# EAGLE schematic Power Board rev3 (EAGLE 8.2.1)
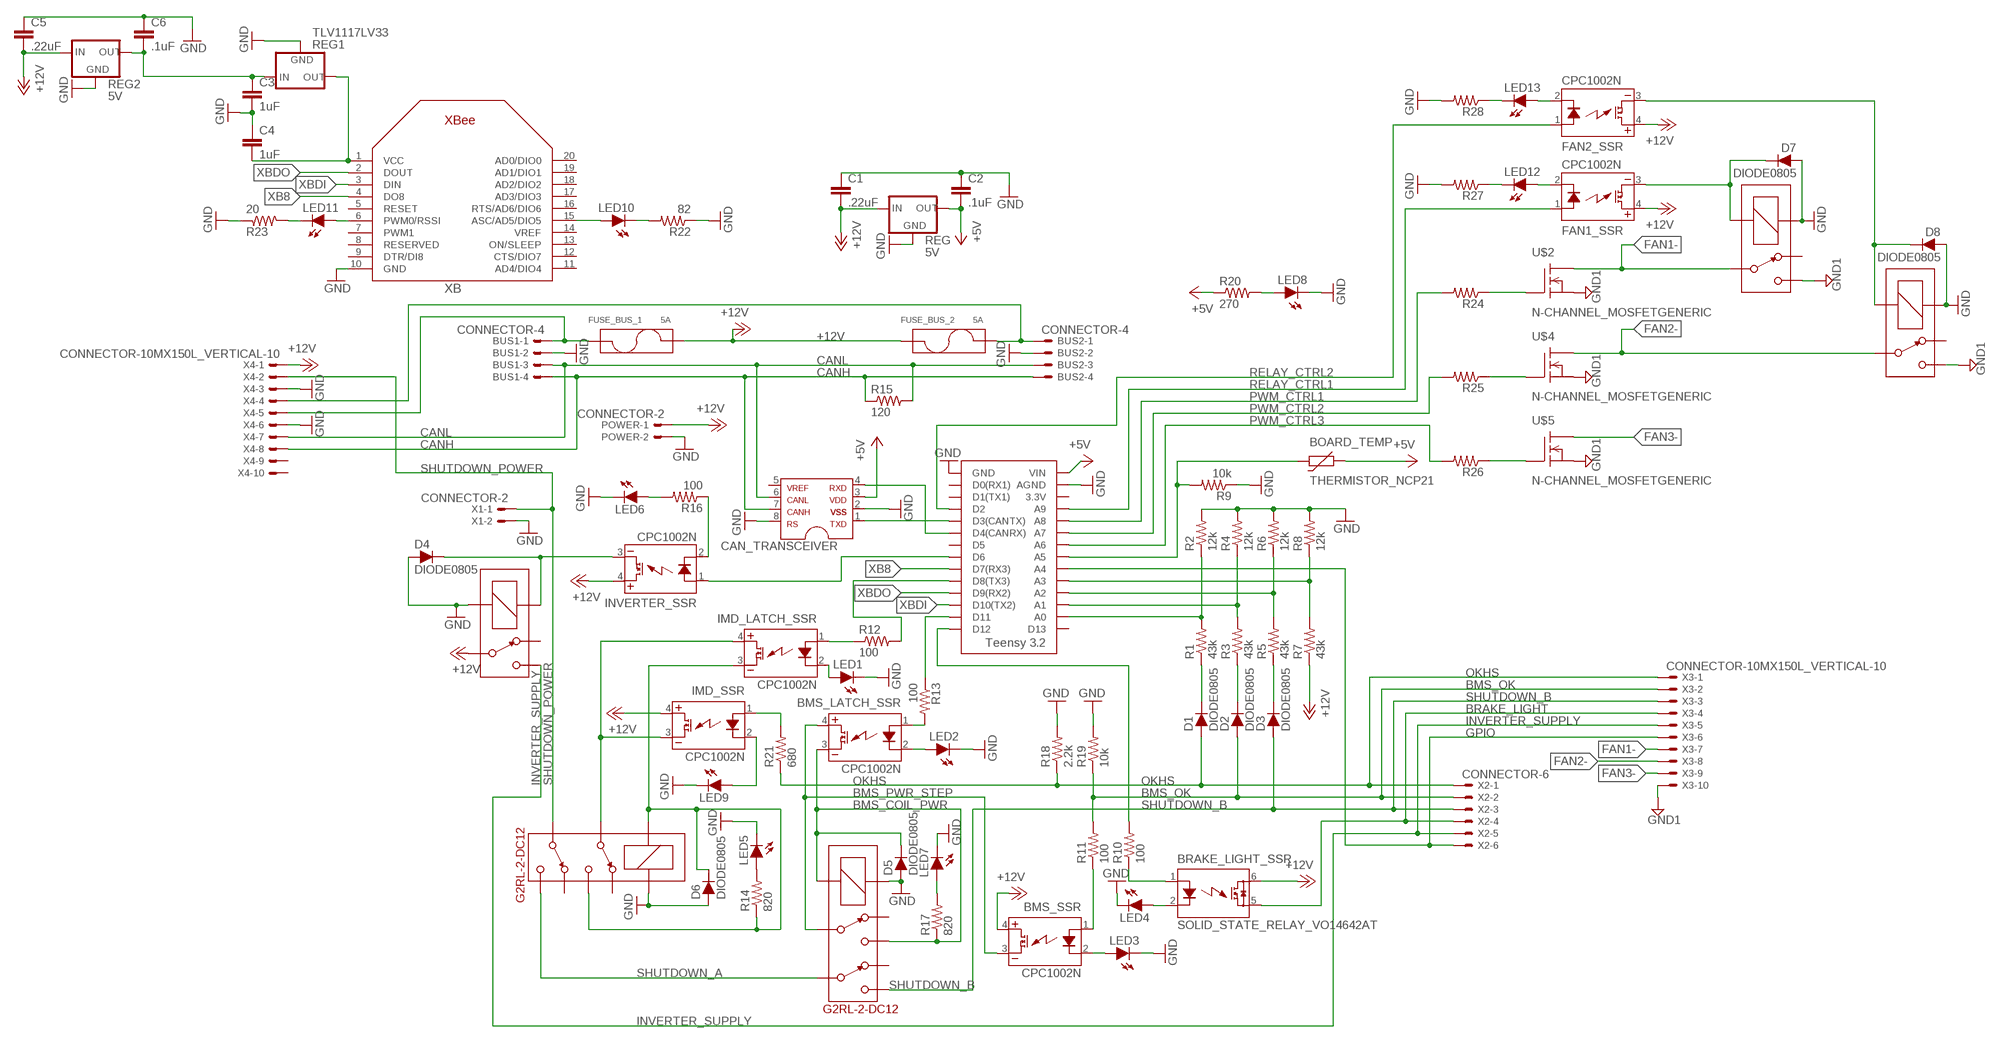
[diagram p0: schematic, sheet 1]

## Parts
BMS_LATCH_SSR  CPC1002N  [SOP04]
BMS_SSR  CPC1002N  [SOP04]
BOARD_TEMP  THERMISTOR_NCP21  [0805]
BRAKE_LIGHT_SSR  SOLID_STATE_RELAY_VO14642AT  [DIL06]
BUS1  CONNECTOR-4  [MINIFIT_5566-4]
BUS2  CONNECTOR-4  [MINIFIT_5566-4]
C1  .22uF  CAP0805  [0805]
C2  .1uF  CAP0805  [0805]
C3  1uF  CAP0805  [0805]
C4  1uF  CAP0805  [0805]
C5  .22uF  CAP0805  [0805]
C6  .1uF  CAP0805  [0805]
CAN_TRANSCEIVER  MCP2551  [SOIC-08]
D1  DIODE0805  [0805_D]
D2  DIODE0805  [0805_D]
D3  DIODE0805  [0805_D]
D4  DIODE0805  [0805_D]
D5  DIODE0805  [0805_D]
D6  DIODE0805  [0805_D]
D7  DIODE0805  [0805_D]
D8  DIODE0805  [0805_D]
FAN1_SSR  CPC1002N  [SOP04]
FAN2_SSR  CPC1002N  [SOP04]
FUSE_BUS_1  5A  FUSE_MINIBLADE  [MINI-BLADE_FUSE_HOLDER]
FUSE_BUS_2  5A  FUSE_MINIBLADE  [MINI-BLADE_FUSE_HOLDER]
IMD_LATCH_SSR  CPC1002N  [SOP04]
IMD_SHUTDOWN  G2RL-2-DC12  [G2RL-2]
IMD_SHUTDOWN1  G2RL-2-DC12  [G2RL-2]
IMD_SSR  CPC1002N  [SOP04]
INVERTER_SSR  CPC1002N  [SOP04]
LED1  LED-0805  [LED-805]
LED2  LED-0805  [LED-805]
LED3  LED-0805  [LED-805]
LED4  LED-0805  [LED-805]
LED5  LED-0805  [LED-805]
LED6  LED-0805  [LED-805]
LED7  LED-0805  [LED-805]
LED8  LED-0805  [LED-805]
LED9  LED-0805  [LED-805]
LED10  LED-0805  [LED-805]
LED11  LED-0805  [LED-805]
LED12  LED-0805  [LED-805]
LED13  LED-0805  [LED-805]
POWER  CONNECTOR-2  [MINIFIT_5566-2]
R1  43k  RESISTOR0805-RES  [0805]
R2  12k  RESISTOR0805-RES  [0805]
R3  43k  RESISTOR0805-RES  [0805]
R4  12k  RESISTOR0805-RES  [0805]
R5  43k  RESISTOR0805-RES  [0805]
R6  12k  RESISTOR0805-RES  [0805]
R7  43k  RESISTOR0805-RES  [0805]
R8  12k  RESISTOR0805-RES  [0805]
R9  10k  RESISTOR0805-RES  [0805]
R10  100  RESISTOR0805-RES  [0805]
R11  100  RESISTOR0805-RES  [0805]
R12  100  RESISTOR0805-RES  [0805]
R13  100  RESISTOR0805-RES  [0805]
R14  820  RESISTOR0805-RES  [0805]
R15  120  RESISTOR0805-RES  [0805]
R16  100  RESISTOR0805-RES  [0805]
R17  820  RESISTOR0805-RES  [0805]
R18  2.2k  RESISTOR0805-RES  [0805]
R19  10k  RESISTOR0805-RES  [0805]
R20  270  RESISTOR0805-RES  [0805]
R21  680  RESISTOR0805-RES  [0805]
R22  82  RESISTOR0805-RES  [0805]
R23  20  RESISTOR0805-RES  [0805]
R24  RESISTOR0805-RES  [0805]
R25  RESISTOR0805-RES  [0805]
R26  RESISTOR0805-RES  [0805]
R27  RESISTOR0805-RES  [0805]
R28  RESISTOR0805-RES  [0805]
REG  5V  5V_REGULATOR_LM340-NLM340MPX-5.0/NOPB  [SOT223]
REG1  TLV1117LV33  [SOT223]
REG2  5V  5V_REGULATOR_LM340-NLM340MPX-5.0/NOPB  [SOT223]
U$1  G5LE  [ZF112]
U$2  N-CHANNEL_MOSFETGENERIC  [TO-220-SINK]
U$3  TEENSY_3.2_SIMPLE  [TEENSY_3.2_SIMPLE]
U$4  N-CHANNEL_MOSFETGENERIC  [TO-220-SINK]
U$5  N-CHANNEL_MOSFETGENERIC  [TO-220-SINK]
U$6  G5LE  [ZF112]
U$7  G5LE  [ZF112]
X1  CONNECTOR-2  [MINIFIT_5566-2]
X2  CONNECTOR-6  [MINIFIT_5566-6]
X3  CONNECTOR-10MX150L_VERTICAL-10  [MX150L_VERTICAL-10]
X4  CONNECTOR-10MX150L_VERTICAL-10  [MX150L_VERTICAL-10]
XB  XBEE  [XBEE]

## Nets
12V_F1: BUS1.1 FUSE_BUS_1.L1(P1) FUSE_BUS_1.L2(P1) X4.5
12V_F2: BUS2.1 FUSE_BUS_2.R1(P2) FUSE_BUS_2.R2(P2) X4.4
12VSUPPLY_READ: R7.2 R8.1 U$3.A3
+5V: BOARD_TEMP.1 C2.2 CAN_TRANSCEIVER.3 R20.1 REG.3(OUT) U$3.VIN
+12V: BMS_SSR.4(DC+) BRAKE_LIGHT_SSR.6(IO1) C1.2 C5.2 FAN1_SSR.4(DC+) FAN2_SSR.4(DC+) FUSE_BUS_1.R1(P2) FUSE_BUS_1.R2(P2) FUSE_BUS_2.L1(P1) FUSE_BUS_2.L2(P1) IMD_SSR.4(DC+) INVERTER_SSR.4(DC+) POWER.1 R7.1 REG2.1(IN) REG.1(IN) U$1.P X4.1
BMS_COIL_PWR: BMS_LATCH_SSR.3(DC-) D5.C IMD_SHUTDOWN1.4 IMD_SHUTDOWN1.COIL- R17.1
BMS_OK: D2.A R11.2 R19.1 X2.2 X3.2
BMS_OK_READ: R3.2 R4.1 U$3.A1
BMS_PWR_STEP: BMS_LATCH_SSR.4(DC+) BMS_SSR.3(DC-) IMD_SHUTDOWN1.3
BRAKE_LIGHT: BRAKE_LIGHT_SSR.5(IO2) X2.4 X3.4
CANH: BUS1.4 BUS2.4 CAN_TRANSCEIVER.7 R15.1 X4.8
CANL: BUS1.3 BUS2.3 CAN_TRANSCEIVER.6 R15.2 X4.7
FAN1-: U$2.2(D) U$6.P X3.7
FAN2-: U$4.2(D) U$7.P X3.8
FAN3-: U$5.2(D) X3.9
GND: BUS1.2 BUS2.2 C1.1 C2.1 C3.2 C4.1 C5.1 C6.1 CAN_TRANSCEIVER.2 CAN_TRANSCEIVER.8 D4.A D5.A D6.A D7.A D8.A IMD_SHUTDOWN1.COIL+ IMD_SHUTDOWN.COIL+ LED1.C LED2.C LED3.C LED4.C LED5.C LED6.C LED7.C LED8.C LED9.C POWER.2 R2.2 R4.2 R6.2 R8.2 R9.1 R18.2 R19.2 R22.1 R23.1 R27.2 R28.2 REG1.1(GND) REG2.2(GND) REG2.4(GND) REG.2(GND) REG.4(GND) U$1.2(COIL-) U$3.AGND U$3.GND U$6.1(COIL+) U$7.1(COIL+) X1.2 X4.3 X4.6 XB.10(GND)
GND1: U$2.3(S) U$4.3(S) U$5.3(S) U$6.S U$7.S X3.10
GPIO: U$3.A4 X2.6 X3.6
INVERTER_SUPPLY: U$1.S X2.5 X3.5
N$1: IMD_LATCH_SSR.2(CONTROL-) LED1.A
N$2: CAN_TRANSCEIVER.4 U$3.D4(CANRX)
N$3: CAN_TRANSCEIVER.1 U$3.D3(CANTX)
N$4: D7.C FAN1_SSR.3(DC-) U$6.2(COIL-)
N$5: IMD_LATCH_SSR.1(CONTROL+) R12.1
N$6: D6.C IMD_LATCH_SSR.3(DC-) IMD_SHUTDOWN.4 IMD_SHUTDOWN.COIL- R14.1
N$7: BRAKE_LIGHT_SSR.2(LED-) LED4.A
N$8: R12.2 U$3.D8(TX3)
N$9: BMS_SSR.2(CONTROL-) LED3.A
N$10: LED10.A XB.15(ASC/AD5/DIO5)
N$11: LED10.C R22.2
N$12: BMS_LATCH_SSR.1(CONTROL+) R13.2
N$13: R10.2 U$3.D12
N$14: R13.1 U$3.D11
N$15: BOARD_TEMP.2 R9.2 U$3.A5
N$16: BMS_LATCH_SSR.2(CONTROL-) LED2.A
N$17: BRAKE_LIGHT_SSR.1(LED+) R10.1
N$18: BMS_SSR.1(CONTROL+) R11.1
N$19: LED5.A R14.2
N$20: D8.C FAN2_SSR.3(DC-) U$7.2(COIL-)
N$21: INVERTER_SSR.1(CONTROL+) U$3.D6
N$22: D1.C R1.1
N$23: D2.C R3.1
N$24: D3.C R5.1
N$25: LED11.A XB.6(PWM0/RSSI)
N$26: D4.C INVERTER_SSR.3(DC-) U$1.1(COIL+)
N$27: INVERTER_SSR.2(CONTROL-) R16.1
N$28: LED6.A R16.2
N$29: LED8.A R20.2
N$30: IMD_LATCH_SSR.4(DC+) IMD_SHUTDOWN.3 IMD_SSR.3(DC-)
N$31: IMD_SSR.1(CONTROL+) R21.2
N$32: LED7.A R17.2
N$33: LED11.C R23.2
N$34: IMD_SSR.2(CONTROL-) LED9.A
N$35: C3.1 C6.2 REG1.3(IN) REG2.3(OUT)
N$36: LED13.C R28.1
N$37: LED12.C R27.1
N$38: FAN1_SSR.2(CONTROL-) LED12.A
N$39: R24.1 U$2.1(G)
N$40: R25.1 U$4.1(G)
N$41: R26.1 U$5.1(G)
N$42: FAN2_SSR.2(CONTROL-) LED13.A
OKHS: D1.A R18.1 R21.1 X2.1 X3.1
OKHS_READ: R1.2 R2.1 U$3.A0
PWM_CTRL1: R24.2 U$3.A8
PWM_CTRL2: R25.2 U$3.A7
PWM_CTRL3: R26.2 U$3.A6
RELAY_CTRL1: FAN1_SSR.1(CONTROL+) U$3.A9
RELAY_CTRL2: FAN2_SSR.1(CONTROL+) U$3.D2
SHUTDOWN_A: IMD_SHUTDOWN1.6 IMD_SHUTDOWN.5
SHUTDOWN_B: D3.A IMD_SHUTDOWN1.5 X2.3 X3.3
SHUTDOWN_OUT_READ: R5.2 R6.1 U$3.A2
SHUTDOWN_POWER: IMD_SHUTDOWN.6 X1.1 X4.2
VCC: C4.2 REG1.2(OUT) REG1.4(OUT) XB.1(VCC)
XB8: U$3.D7(RX3) XB.4(DO8)
XBDI: U$3.D10(TX2) XB.3(DIN)
XBDO: U$3.D9(RX2) XB.2(DOUT)
Unconnected: CAN_TRANSCEIVER.5 IMD_SHUTDOWN1.2 IMD_SHUTDOWN1.7 IMD_SHUTDOWN.2 IMD_SHUTDOWN.7 U$1.O U$3.3.3V U$3.D0(RX1) U$3.D1(TX1) U$3.D5 U$3.D13 U$6.O U$7.O X4.9 X4.10 XB.5(RESET) XB.7(PWM1) XB.8(RESERVED) XB.9(DTR/DI8) XB.11(AD4/DIO4) XB.12(CTS/DIO7) XB.13(ON/SLEEP) XB.14(VREF) XB.16(RTS/AD6/DIO6) XB.17(AD3/DIO3) XB.18(AD2/DIO2) XB.19(AD1/DIO1) XB.20(AD0/DIO0)

## Library data of the parts
BMS_LATCH_SSR BMS_SSR FAN1_SSR FAN2_SSR IMD_LATCH_SSR IMD_SSR INVERTER_SSR = HyTechDevices:CPC1002N: IXYS Solid State Relay .7A
BOARD_TEMP = HyTechDevices:THERMISTOR_NCP21: Murata NCP21 10k Thermistor Datasheet <http://www.murata.com/~/media/webrenewal/support/library/catalog/products/thermistor/ntc/r44e.ashx>
BRAKE_LIGHT_SSR = HyTechDevices:SOLID_STATE_RELAY
BUS1 BUS2 = HyTechDevices:CONNECTOR-4: Mini-Fit Junior connector 4 pole Source: http://www.molex.com; OC_FARNELL: unknown; OC_NEWARK: unknown
C1-C6 = HyTechDevices:CAP: Capacitor Standard 0603 ceramic capacitor, and 0.1" leaded capacitor.
CAN_TRANSCEIVER = HyTechDevices:MCP2551: MCP2551 High-Speed CAN Transceiver Product Webpage <https://www.microchip.com/wwwproducts/en/MCP2551> Datasheet <http://ww1.microchip.com/downloads/en/DeviceDoc/21667f.pdf> This device is outdated It is replaced by MCP2561. Comparison Page <https://www.microchip.com/wwwproducts/ProductCompare/MCP2551/MCP2561> Product Webpage <https://www.microchip.com/wwwproducts/en/MCP2561> Datasheet <http://ww1.microchip.com/downloads/en/DeviceDoc/20005167C.pdf>
D1-D8 = HyTechDevices:DIODE: DIODE general purpose rectifier
FUSE_BUS_1 FUSE_BUS_2 = HyTechDevices:FUSE: Fuse/Fuseclips Keystone Electronics 3568 Fuse Mouser Part <http://www.mouser.com/ProductDetail/Keystone-Electronics/3568> Datasheet <http://www.mouser.com/ds/2/215/568-742601.pdf> Bussman/Eaton Midget Fuse Clip 1A3400 <http://www.mouser.com/ProductDetail/Bussmann-Eaton/BK-1A3400-09-R/?qs=sGAEpiMZZMuG%252bgnN5hGYGzzlAelq2OxnKqVSMVjq8I4%3d> Schurter 0751.0110 Brass Fuse Clip Datasheet <http://www.mouser.com/ds/2/358/typ_OG__Clip__5x20-2553.pdf>
IMD_SHUTDOWN IMD_SHUTDOWN1 = HyTechDevices:G2RL-2-DC12: Omron G2RL-2 Double Pull Double Throw Relay Coil Voltage: 12VDC (8.4-18VDC @60ºC) Contact Amperage: 8A at 30VDC Datasheet <https://www.omron.com/ecb/products/pdf/en-g2rl.pdf>
LED1-LED13 = HyTechDevices:LED: Light Emitting Diode (LED) Source: Dangerous Prototypes Eagle Library <https://github.com/DangerousPrototypes/Eagle_Part_Library>
POWER X1 = HyTechDevices:CONNECTOR-2: Mini-Fit Junior connector 2 pole Source: http://www.molex.com; OC_FARNELL: 1822072; OC_NEWARK: unknown
R1-R28 = HyTechDevices:RESISTOR: Resistor Basic schematic elements and footprints for 0603, 1206, and PTH resistors.
REG REG2 = HyTechDevices:5V_REGULATOR_LM340-N: Voltage Regulator 5v linear voltage regulator Datasheet <http://www.mouser.com/ProductDetail/Texas-Instruments/LM340MPX-50-NOPB/?qs=X1J7HmVL2ZGZwtTFRQ9ItA%3D%3D> MAX current out: 1.5A MAX voltage in: 35V
REG1 = HyTechDevices:TLV1117LV33: Texas Instruments TLV1117LV33 3.3V Linear Regulator
U$1 U$6 U$7 = HyTechDevices:G5LE: Omron G5LE SPST Relay 5 VDC, 12VDC, 24VDC models Coil voltage: 75% - 170% of nominal voltage Datasheet <https://www.omron.com/ecb/products/pdf/en-g5le.pdf>
U$2 U$4 U$5 = HyTechDevices:N-CHANNEL_MOSFET: Generic N-Channel MOSFET; _EXTERNAL_: 1
U$3 = HyTechDevices:TEENSY_3.2_SIMPLE: Simple version of the Teensy 3.2 board that only uses the 2 main rows of pins, not the inner pins or the pins opposite the usb port.
X2 = HyTechDevices:CONNECTOR-6: Mini-Fit Junior connector 6 pole Source: http://www.molex.com; MPN: 95566-61002; OC_FARNELL: unknown; OC_NEWARK: 22K8620
X3 X4 = HyTechDevices:CONNECTOR-10: Mini-Fit Junior connector 10 pole Source: http://www.molex.com
XB = HyTechDevices:XBEE: Source: Adafruit <https://github.com/adafruit/Adafruit-Eagle-Library>